# Altium project PCB_Project.PrjPcb
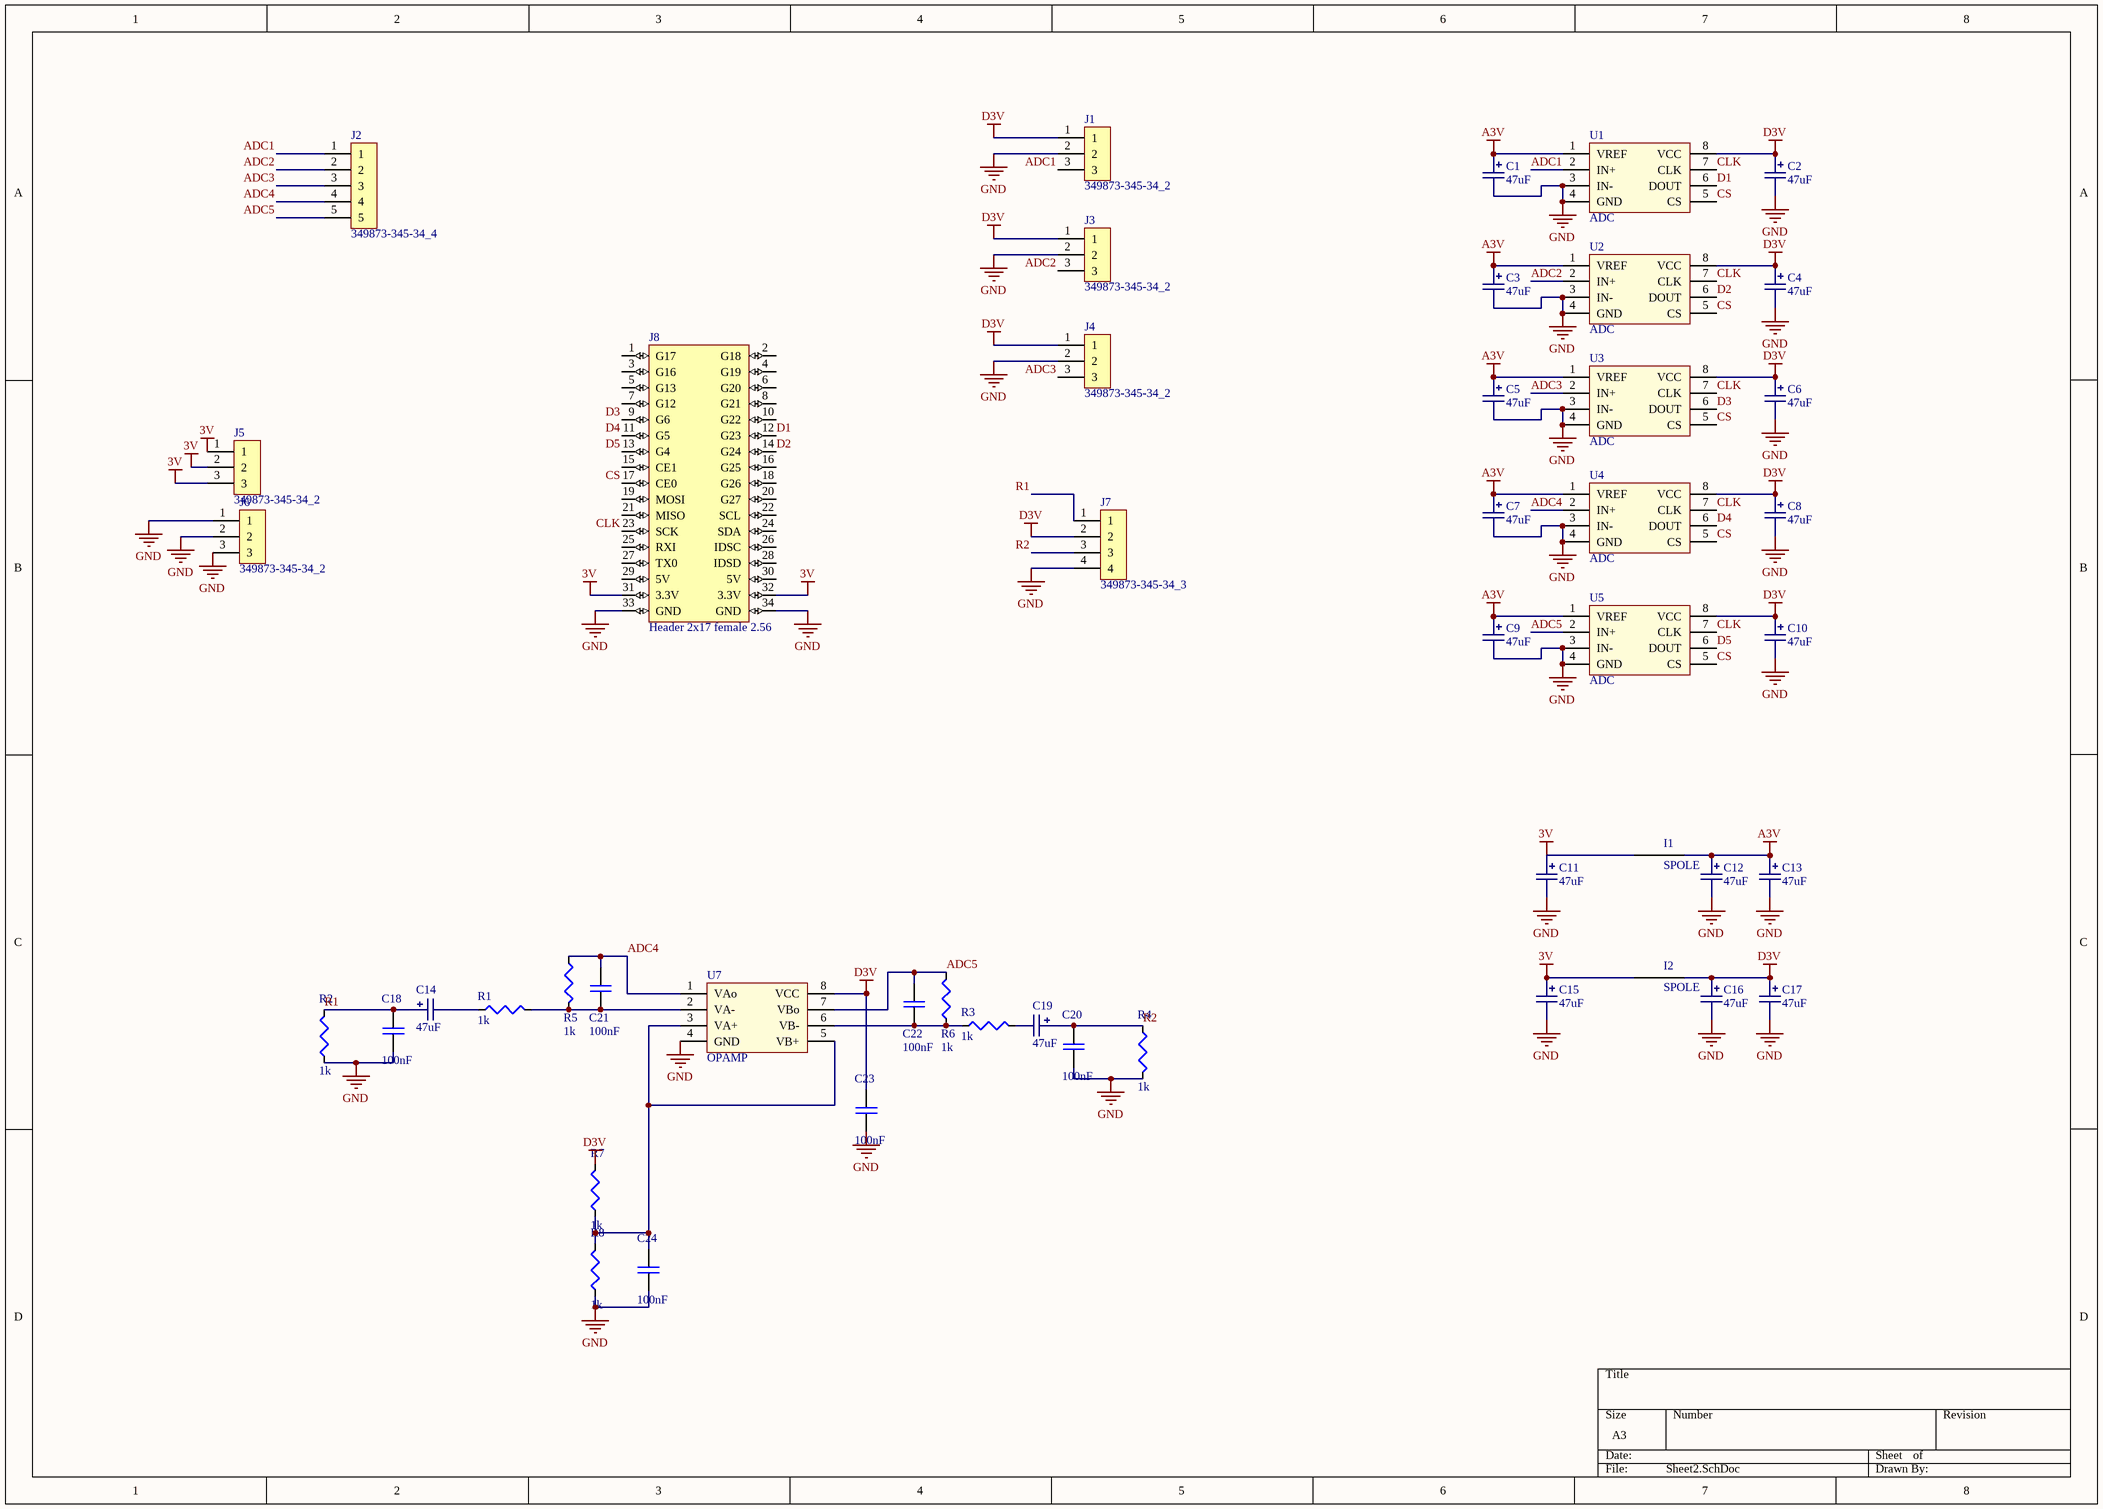
[diagram p0: Sheet2.SchDoc]
1 sheet, 48 parts. Net scope: global (net labels, ports and power ports of the same name join across sheets).
Board file: PCB1.PcbDoc

## Sheet Sheet2.SchDoc
size A3

### Parts
C1  47uF  [CAPPR20D05H11]
C2  47uF  [CAPPR20D05H11]
C3  47uF  [CAPPR20D05H11]
C4  47uF  [CAPPR20D05H11]
C5  47uF  [CAPPR20D05H11]
C6  47uF  [CAPPR20D05H11]
C7  47uF  [CAPPR20D05H11]
C8  47uF  [CAPPR20D05H11]
C9  47uF  [CAPPR20D05H11]
C10  47uF  [CAPPR20D05H11]
C11  47uF  [CAPPR20D05H11]
C12  47uF  [CAPPR20D05H11]
C13  47uF  [CAPPR20D05H11]
C14  47uF  [CAPPR20D05H11]
C15  47uF  [CAPPR20D05H11]
C16  47uF  [CAPPR20D05H11]
C17  47uF  [CAPPR20D05H11]
C18  value 100nF  [C0805]  (hidden comment: 08053C105KAT2A)
C19  47uF  [CAPPR20D05H11]
C20  value 100nF  [C0805]  (hidden comment: 08053C105KAT2A)
C21  value 100nF  [C0805]  (hidden comment: 08053C105KAT2A)
C22  value 100nF  [C0805]  (hidden comment: 08053C105KAT2A)
C23  value 100nF  [C0805]  (hidden comment: 08053C105KAT2A)
C24  value 100nF  [C0805]  (hidden comment: 08053C105KAT2A)
I1  SPOLE  [PCBComponent_1]
I2  SPOLE  [PCBComponent_1]
J1  349873-345-34_2  [Header 1x3 male]
J2  349873-345-34_4  [Header 1x5 male]
J3  349873-345-34_2  [Header 1x3 male]
J4  349873-345-34_2  [Header 1x3 male]
J5  349873-345-34_2  [Header 1x3 male]
J6  349873-345-34_2  [Header 1x3 male]
J7  349873-345-34_3  [Header 1x4 male]
J8  Header 2x17 female 2.56  [Header 2x17 female 2.56]
R1  value 1k  [R0805]  (hidden comment: CRCW08050000Z0EA)
R2  value 1k  [R0805]  (hidden comment: CRCW08050000Z0EA)
R3  value 1k  [R0805]  (hidden comment: CRCW08050000Z0EA)
R4  value 1k  [R0805]  (hidden comment: CRCW08050000Z0EA)
R5  value 1k  [R0805]  (hidden comment: CRCW08050000Z0EA)
R6  value 1k  [R0805]  (hidden comment: CRCW08050000Z0EA)
R7  value 1k  [R0805]  (hidden comment: CRCW08050000Z0EA)
R8  value 1k  [R0805]  (hidden comment: CRCW08050000Z0EA)
U1  ADC  [SOKKEL8]
U2  ADC  [SOKKEL8]
U3  ADC  [SOKKEL8]
U4  ADC  [SOKKEL8]
U5  ADC  [SOKKEL8]
U7  OPAMP  [SOKKEL8]

### Nets
3V: C11.2 C15.2 I1.1 I2.1 J5.1 J5.2 J5.3 J8.31(3.3V) J8.32(3.3V)
A3V: C1.2 C3.2 C5.2 C7.2 C9.2 C12.2 C13.2 I1.2 U1.1(VREF) U2.1(VREF) U3.1(VREF) U4.1(VREF) U5.1(VREF)
D3V: C2.2 C4.2 C6.2 C8.2 C10.2 C16.2 C17.2 C23.2 I2.2 J1.1 J3.1 J4.1 J7.2 R7.2 U1.8(VCC) U2.8(VCC) U3.8(VCC) U4.8(VCC) U5.8(VCC) U7.8(VCC)
GND: C1.1 C2.1 C3.1 C4.1 C5.1 C6.1 C7.1 C8.1 C9.1 C10.1 C11.1 C12.1 C13.1 C15.1 C16.1 C17.1 C18.1 C20.1 C23.1 C24.1 J1.2 J3.2 J4.2 J6.1 J6.2 J6.3 J7.4 J8.33(GND) J8.34(GND) R2.1 R4.1 R8.1 U1.3(IN-) U1.4(GND) U2.3(IN-) U2.4(GND) U3.3(IN-) U3.4(GND) U4.3(IN-) U4.4(GND) U5.3(IN-) U5.4(GND) U7.4(GND)
ADC1: J1.3 J2.1 U1.2(IN+)
ADC2: J2.2 J3.3 U2.2(IN+)
ADC3: J2.3 J4.3 U3.2(IN+)
ADC4: C21.1 J2.4 R5.1 U4.2(IN+) U7.1(VAo)
ADC5: C22.1 J2.5 R6.1 U5.2(IN+) U7.7(VBo)
CLK: J8.23(SCK) U1.7(CLK) U2.7(CLK) U3.7(CLK) U4.7(CLK) U5.7(CLK)
CS: J8.17(CE0) U1.5(CS) U2.5(CS) U3.5(CS) U4.5(CS) U5.5(CS)
D1: J8.12(G23) U1.6(DOUT)
D2: J8.14(G24) U2.6(DOUT)
D3: J8.9(G6) U3.6(DOUT)
D4: J8.11(G5) U4.6(DOUT)
D5: J8.13(G4) U5.6(DOUT)
R1: C14.2 C18.2 J7.1 R2.2
R2: C19.2 C20.2 J7.3 R4.2
NetC14_1: C14.1 R1.2
NetC19_1: C19.1 R3.1
NetC21_2: C21.2 R1.1 R5.2 U7.2(VA-)
NetC22_2: C22.2 R3.2 R6.2 U7.6(VB-)
NetC24_2: C24.2 R7.1 R8.2 U7.3(VA+) U7.5(VB+)

Not connected (* = marked no-connect by the designer): J8 1(G17) 2(G18) 3(G16) 4(G19) 5(G13) 6(G20) 7(G12) 8(G21) 10(G22) 15(CE1) 16(G25) 18(G26) 19(MOSI) 20(G27) 21(MISO) 22(SCL) 24(SDA) 25(RXI) 26(IDSC) 27(TX0) 28(IDSD) 29(5V) 30(5V)

### Library data of the parts
C1-C17 C19 = 3269: 25V, Elektrolytt; id: 3269; rad: 7; rom: OV; lager_type: Fremlager; dybde: 5; hylle: 4; antall: 58; pakke_opprettet_av: 1335; symbol_opprettet_av: 815; leverandor_varenr: 9451072; pris: 1; nokkelord: Kondensator, capacitor, Elektrolytt; leverandor: Farnell; pakketype: TH; komponenttype: 2; pakke_opprettet: 2016-11-13 14:55:27; symbol_opprettet: 2014-06-28 15:26:13; navn: 47uF
C18 C20-C24 = 08053C105KAT2A: C0805
J1 J3-J6 = 349873-345-34_2: Header 1x3 male 2.54mm
J2 = 349873-345-34_4: Header 1x5 male 2.54mm
J7 = 349873-345-34_3: Header 1x4 male 2.54mm
R1-R8 = CRCW08050000Z0EA: R0805